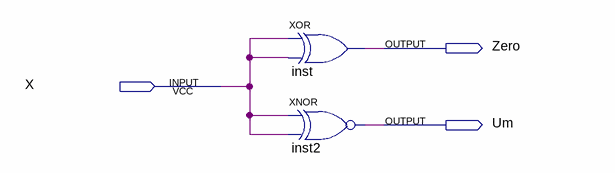
[diagram p0: schematic sheet]
// Quartus schematic Constante.bdf as structural Verilog: 2 symbols, 3 pins
module Constante (
  input  X,
  output Zero,
  output Um
);

  xor inst (Zero, X, X);
  xnor inst2 (Um, X, X);
endmodule
